# Altium schematic sheet Logica.SchDoc
size A4
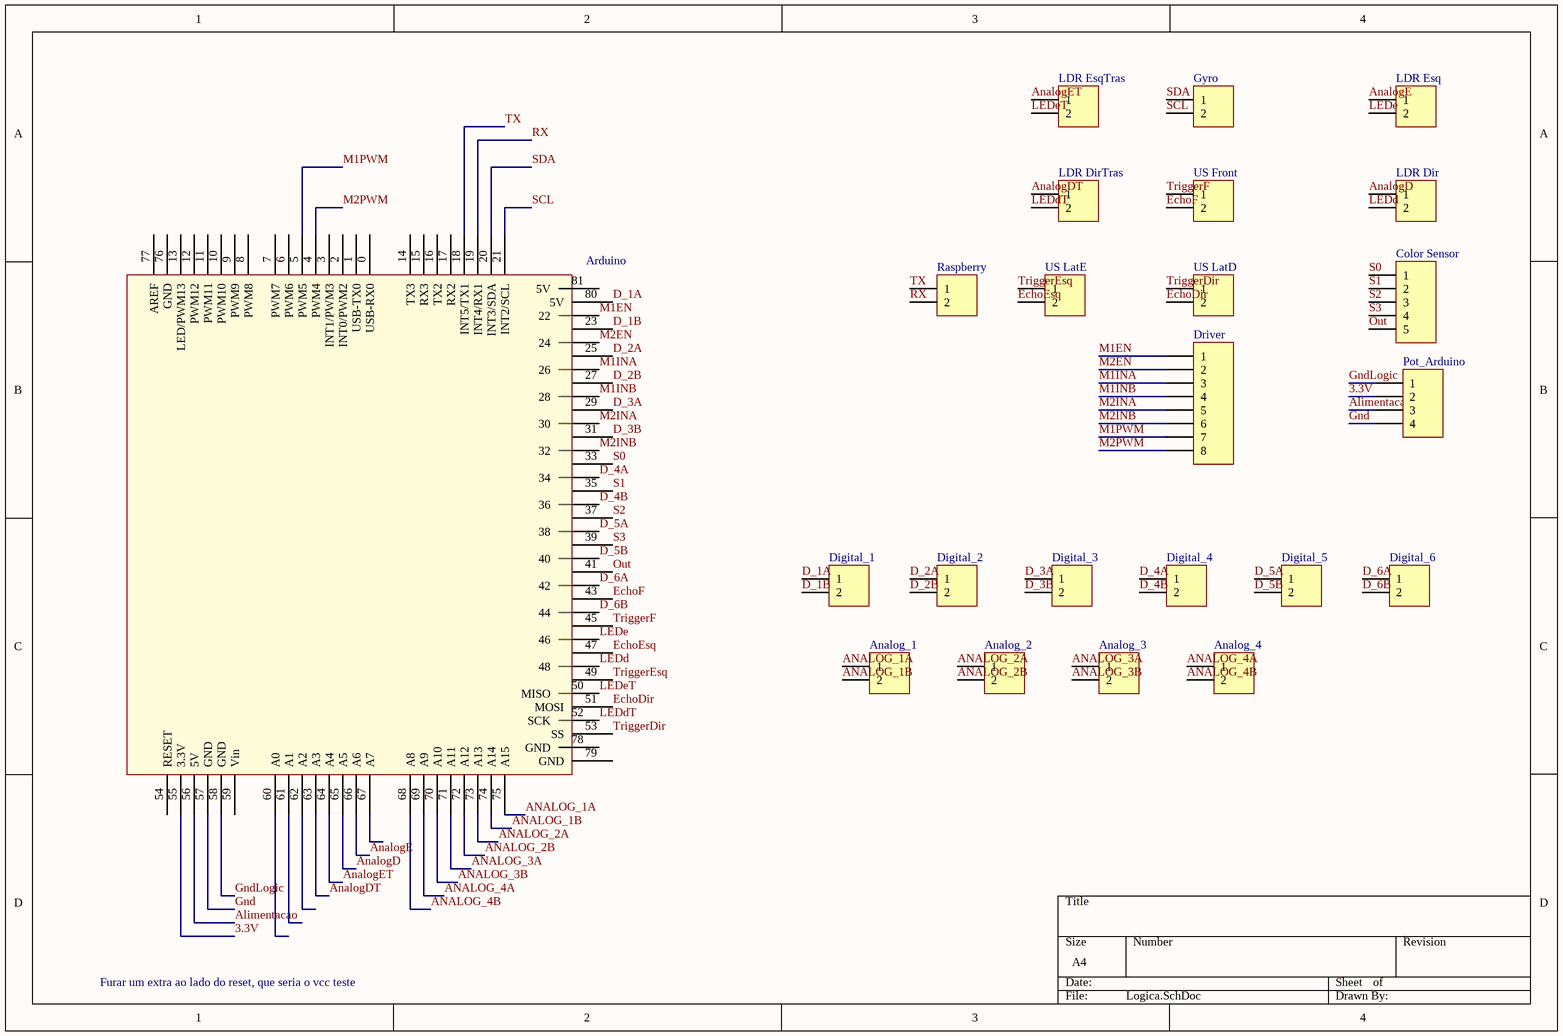
[diagram p0: Logica.SchDoc]

## Parts
Analog_1  Header 2  [HDR1X2]  (value not drawn)
Analog_2  Header 2  [HDR1X2]  (value not drawn)
Analog_3  Header 2  [HDR1X2]  (value not drawn)
Analog_4  Header 2  [HDR1X2]  (value not drawn)
Arduino  Arduino  [Arduino]  (value not drawn)
Color_Sensor  Header 5  [HDR1X5]  (value not drawn)
Digital_1  Header 2  [HDR1X2]  (value not drawn)
Digital_2  Header 2  [HDR1X2]  (value not drawn)
Digital_3  Header 2  [HDR1X2]  (value not drawn)
Digital_4  Header 2  [HDR1X2]  (value not drawn)
Digital_5  Header 2  [HDR1X2]  (value not drawn)
Digital_6  Header 2  [HDR1X2]  (value not drawn)
Driver  Header 8  [HDR1X8]  (value not drawn)
Gyro  Header 2  [HDR1X2]  (value not drawn)
LDR_Dir  Header 2  [HDR1X2]  (value not drawn)
LDR_DirTras  Header 2  [HDR1X2]  (value not drawn)
LDR_Esq  Header 2  [HDR1X2]  (value not drawn)
LDR_EsqTras  Header 2  [HDR1X2]  (value not drawn)
Pot_Arduino  Header 4  [HDR1X4]  (value not drawn)
Raspberry  Header 2  [HDR1X2]  (value not drawn)
US_Front  Header 2  [HDR1X2]  (value not drawn)
US_LatD  Header 2  [HDR1X2]  (value not drawn)
US_LatE  Header 2  [HDR1X2]  (value not drawn)

## Nets
3.3V: Arduino.55(3.3V) Pot_Arduino.2
Alimentacao: Arduino.56(5V) Pot_Arduino.3
ANALOG_1A: Analog_1.1 Arduino.75(A15)
ANALOG_1B: Analog_1.2 Arduino.74(A14)
ANALOG_2A: Analog_2.1 Arduino.73(A13)
ANALOG_2B: Analog_2.2 Arduino.72(A12)
ANALOG_3A: Analog_3.1 Arduino.71(A11)
ANALOG_3B: Analog_3.2 Arduino.70(A10)
ANALOG_4A: Analog_4.1 Arduino.69(A9)
ANALOG_4B: Analog_4.2 Arduino.68(A8)
AnalogD: Arduino.65(A5) LDR_Dir.1
AnalogDT: Arduino.63(A3) LDR_DirTras.1
AnalogE: Arduino.66(A6) LDR_Esq.1
AnalogET: Arduino.64(A4) LDR_EsqTras.1
D_1A: Arduino.80(5V) Digital_1.1
D_1B: Arduino.23 Digital_1.2
D_2A: Arduino.25 Digital_2.1
D_2B: Arduino.27 Digital_2.2
D_3A: Arduino.29 Digital_3.1
D_3B: Arduino.31 Digital_3.2
D_4A: Arduino.34 Digital_4.1
D_4B: Arduino.36 Digital_4.2
D_5A: Arduino.38 Digital_5.1
D_5B: Arduino.40 Digital_5.2
D_6A: Arduino.42 Digital_6.1
D_6B: Arduino.44 Digital_6.2
EchoDir: Arduino.51(MOSI) US_LatD.2
EchoEsq: Arduino.47 US_LatE.2
EchoF: Arduino.43 US_Front.2
Gnd: Arduino.57(GND) Pot_Arduino.4
GndLogic: Arduino.58(GND) Pot_Arduino.1
LEDd: Arduino.48 LDR_Dir.2
LEDdT: Arduino.52(SCK) LDR_DirTras.2
LEDe: Arduino.46 LDR_Esq.2
LEDeT: Arduino.50(MISO) LDR_EsqTras.2
M1EN: Arduino.22 Driver.1
M1INA: Arduino.26 Driver.3
M1INB: Arduino.28 Driver.4
M1PWM: Arduino.5(PWM5) Driver.7
M2EN: Arduino.24 Driver.2
M2INA: Arduino.30 Driver.5
M2INB: Arduino.32 Driver.6
M2PWM: Arduino.4(PWM4) Driver.8
Out: Arduino.41 Color_Sensor.5
RX: Arduino.19(INT4/RX1) Raspberry.2
S0: Arduino.33 Color_Sensor.1
S1: Arduino.35 Color_Sensor.2
S2: Arduino.37 Color_Sensor.3
S3: Arduino.39 Color_Sensor.4
SCL: Arduino.21(INT2/SCL) Gyro.2
SDA: Arduino.20(INT3/SDA) Gyro.1
TriggerDir: Arduino.53(SS) US_LatD.1
TriggerEsq: Arduino.49 US_LatE.1
TriggerF: Arduino.45 US_Front.1
TX: Arduino.18(INT5/TX1) Raspberry.1

Not connected (* = marked no-connect by the designer): Arduino 0(USB-RX0) 1(USB-TX0) 2(INT0/PWM2) 3(INT1/PWM3) 6(PWM6) 7(PWM7) 8(PWM8) 9(PWM9) 10(PWM10) 11(PWM11) 12(PWM12) 13(LED/PWM13) 14(TX3) 15(RX3) 16(TX2) 17(RX2) 54(RESET) 59(Vin) 60(A0) 61(A1) 62(A2) 67(A7) 76(GND) 77(AREF) 78(GND) 79(GND) 81(5V)

## Notes on the sheet
- Furar um extra ao lado do reset, que seria o vcc teste

## Library data of the parts
Analog_1-Analog_4 Digital_1-Digital_6 Gyro LDR_Dir LDR_DirTras LDR_Esq LDR_EsqTras Raspberry US_Front US_LatD US_LatE = Header 2: Header, 2-Pin; LatestRevisionDate: 17-Jul-2002; LatestRevisionNote: Re-released for DXP Platform.; Publisher: Altium Limited
Color_Sensor = Header 5: Header, 5-Pin; LatestRevisionDate: 17-Jul-2002; LatestRevisionNote: Re-released for DXP Platform.; Publisher: Altium Limited
Driver = Header 8: Header, 8-Pin; LatestRevisionDate: 17-Jul-2002; LatestRevisionNote: Re-released for DXP Platform.; Publisher: Altium Limited
Pot_Arduino = Header 4: Header, 4-Pin; LatestRevisionDate: 17-Jul-2002; LatestRevisionNote: Re-released for DXP Platform.; Publisher: Altium Limited